# EAGLE design STM8L-FOX_80m_CNTL_V5_3 (EAGLE 7.7.0)
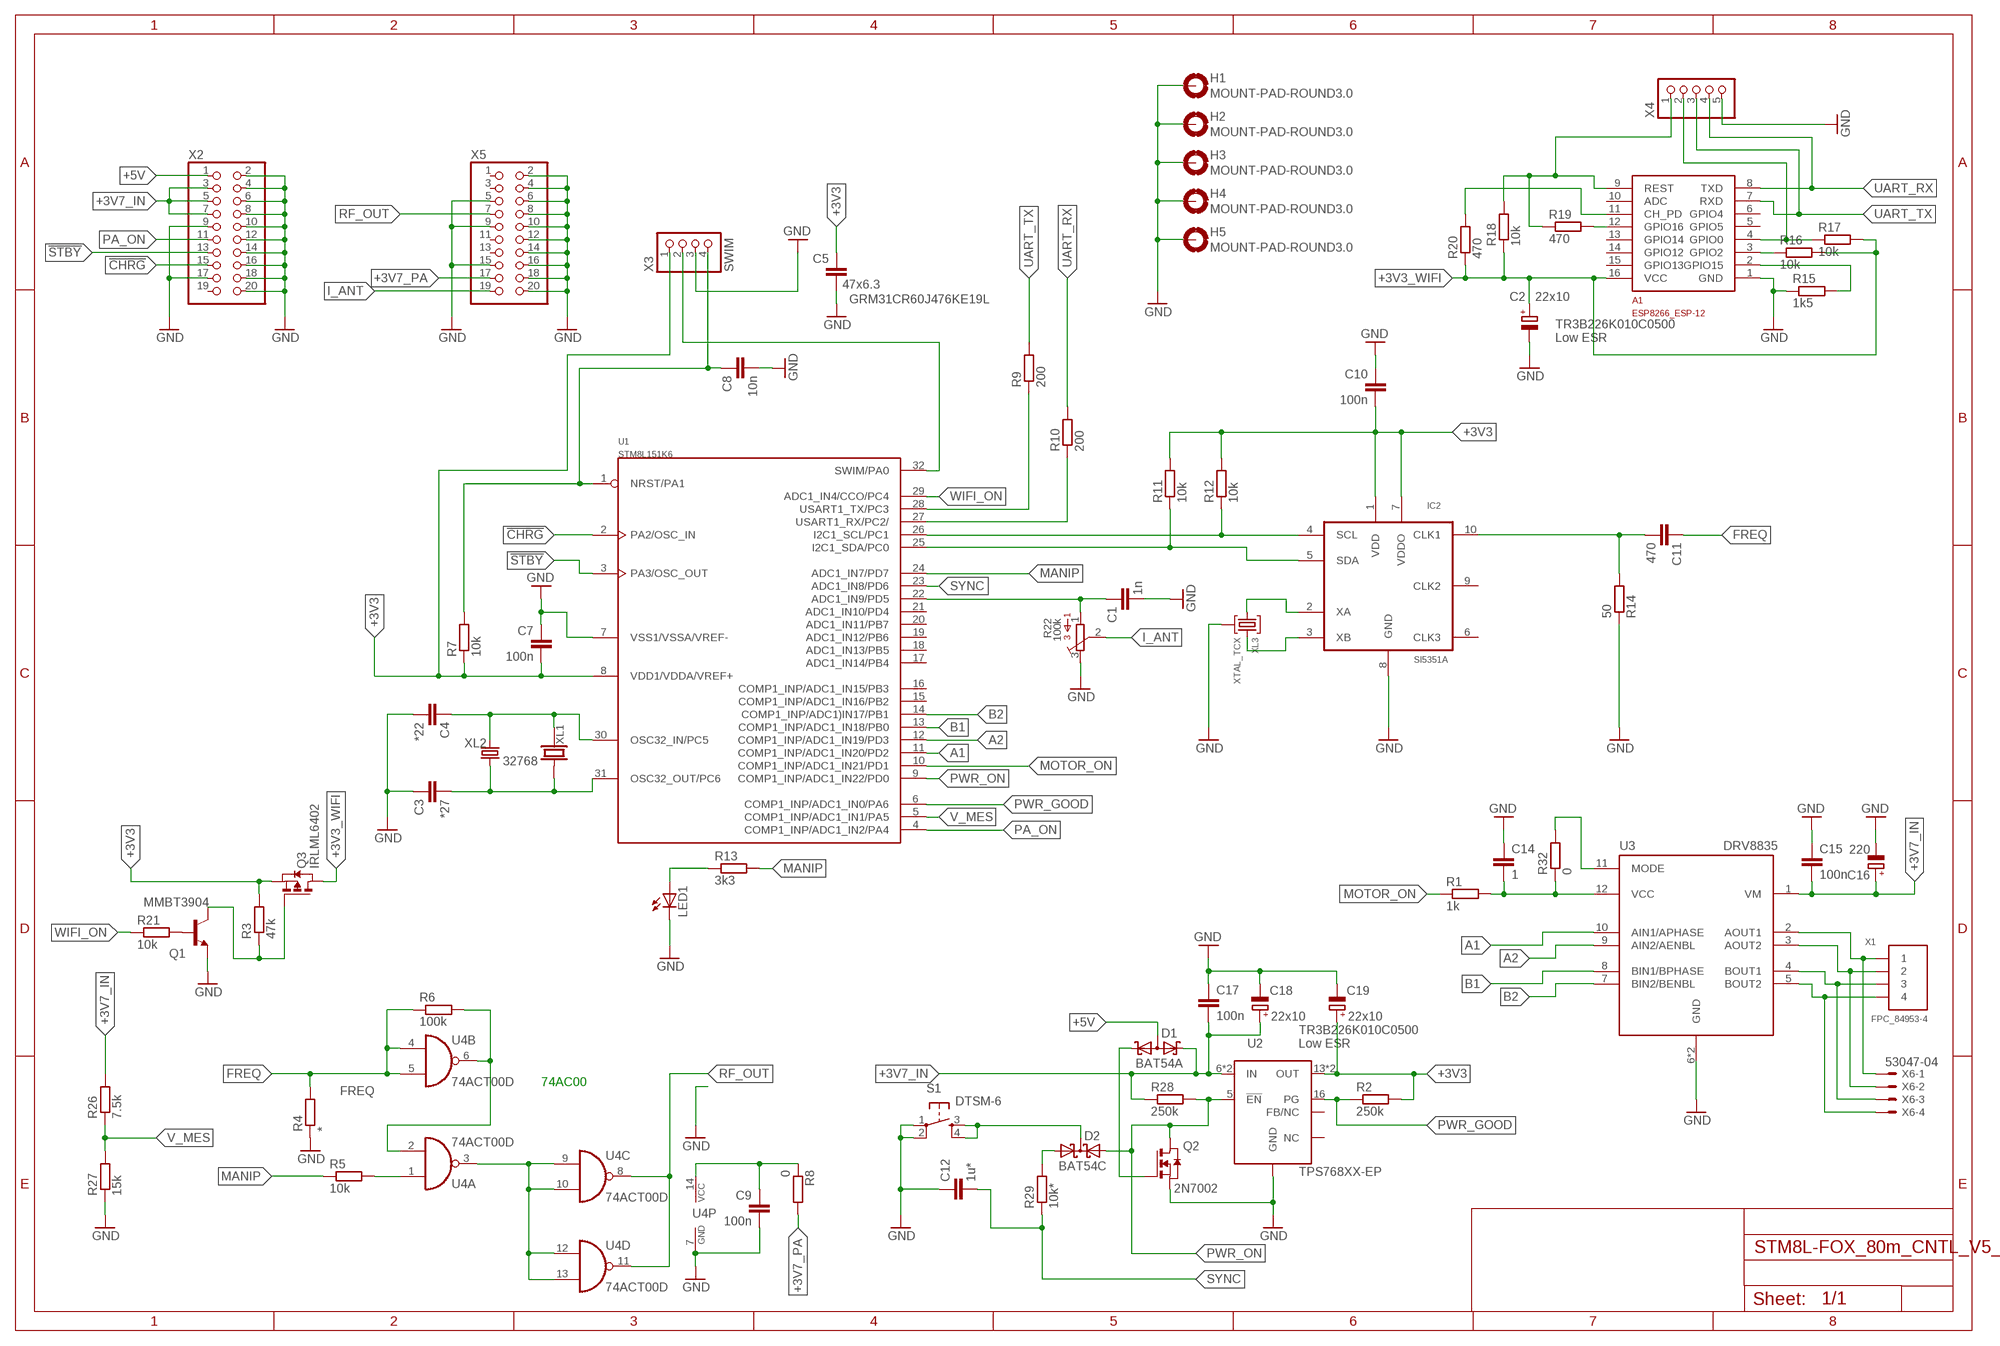
[diagram p0: schematic, sheet 1]

## Parts
A1  ESP8266_ESP-12  [ESP8266-ESP12]
C1  1n  C-EUC1206K  [C1206K]
C2  22x10  CPOL-EUB/3528-21W  [B/3528-21W]
C3  *27  C-EUC0805K  [C0805K]
C4  *22  C-EUC0805K  [C0805K]
C5  47x6.3  C-EUC1206K  [C1206K]
C7  100n  C-EUC1206K  [C1206K]
C8  10n  C-EUC0805K  [C0805K]
C9  100n  C-EUC1206K  [C1206K]
C10  100n  C-EUC1206K  [C1206K]
C11  470  C-EUC1206K  [C1206K]
C12  1u*  C-EUC1206K  [C1206K]
C14  1  C-EUC1206K  [C1206K]
C15  100n  C-EUC1206K  [C1206K]
C16  220  CPOL-EUC/6032-28R  [C/6032-28R]
C17  100n  C-EUC1206K  [C1206K]
C18  22x10  CPOL-EUB/3528-21W  [B/3528-21W]
C19  22x10  CPOL-EUB/3528-21W  [B/3528-21W]
D1  BAT54A  [SOT23]
D2  BAT54C  [SOT23]
H1  MOUNT-PAD-ROUND3.0  [3,0-PAD]
H2  MOUNT-PAD-ROUND3.0  [3,0-PAD]
H3  MOUNT-PAD-ROUND3.0  [3,0-PAD]
H4  MOUNT-PAD-ROUND3.0  [3,0-PAD]
H5  MOUNT-PAD-ROUND3.0  [3,0-PAD]
IC2  SI5351A  [MSOP10]
LED1  LED3MM  [LED3MM]
Q1  MMBT3904  MMBT3904LT1-NPN-SOT23-BEC  [SOT23-BEC]
Q2  2N7002  NMOSSOT23  [SOT-23]
Q3  IRLML6402  [SOT-23]
R1  1k  R-EU_R1206  [R1206]
R2  250k  R-EU_R1206  [R1206]
R3  47k  R-EU_R1206  [R1206]
R4  *  R-EU_R1206  [R1206]
R5  10k  R-EU_R1206  [R1206]
R6  100k  R-EU_R1206  [R1206]
R7  10k  R-EU_R1206  [R1206]
R8  0  R-EU_R1206  [R1206]
R9  200  R-EU_R1206  [R1206]
R10  200  R-EU_R1206  [R1206]
R11  10k  R-EU_R1206  [R1206]
R12  10k  R-EU_R1206  [R1206]
R13  3k3  R-EU_R1206  [R1206]
R14  50  R-EU_R1206  [R1206]
R15  1k5  R-EU_R1206  [R1206]
R16  10k  R-EU_R1206  [R1206]
R17  10k  R-EU_R1206  [R1206]
R18  10k  R-EU_R1206  [R1206]
R19  470  R-EU_R1206  [R1206]
R20  470  R-EU_R1206  [R1206]
R21  10k  R-EU_R1206  [R1206]
R22  100k  3362R  [3362R]
R26  7.5k  R-EU_R1206  [R1206]
R27  15k  R-EU_R1206  [R1206]
R28  250k  R-EU_R1206  [R1206]
R29  10k*  R-EU_R1206  [R1206]
R32  0  R-EU_R1206  [R1206]
S1  DTSM-6  [DTSM-6]
U1  STM8L151K6  [LQFP32-7X7]
U2  TPS768XX-EP  [TSSOP-20-PWP]
U3  DRV8835  [WSON_2X3]
U4  74ACT00D  [SO14]
X1  FPC_84953-4  [FPC_84953-4]
X2  PINHD-2X10  [2X10]
X3  SWIM  PINHD-1X4  [1X04]
X4  PINHD-1X5  [1X05]
X5  PINHD-2X10  [2X10]
X6  53047-04  [53047-04]
XL1  CRYSTALSMD  [EPSON-MC146]
XL2  32768  CRYSTALTC38H-PCB  [TC38H-PCB]
XL3  XTAL_TCX  [TXC]

## Nets
!CHRG!: U1.2(PA2/OSC_IN) X2.15
!STBY!: U1.3(PA3/OSC_OUT) X2.13
+3V3: C5.2 C7.1 C10.1 C19.+ IC2.1(VDD) IC2.7(VDDO) Q3.2(S) R2.2 R3.2 R7.1 R11.2 R12.2 U1.8(VDD1/VDDA/VREF+) U2.13(OUT) U2.14(OUT) X3.1
+3V3_WIFI: A1.16(VCC) C2.+ Q3.3(D) R16.2 R17.2 R18.1 R20.1
+3V7_IN: C15.2 C16.+ C17.2 C18.+ D1.2(K2) R26.2 R28.1 U2.6(IN) U2.7(IN) U3.1(VM) X2.3 X2.5 X2.7
+3V7_PA: R8.2 X5.17
+5V: D1.3(AA) X2.1
A1: U1.11(COMP1_INP/ADC1_IN20/PD2) U3.10(AIN1/APHASE)
A2: U1.12(COMP1_INP/ADC1_IN19/PD3) U3.9(AIN2/AENBL)
B1: U1.13(COMP1_INP/ADC1_IN18/PB0) U3.8(BIN1/BPHASE)
B2: U1.14(COMP1_INP/ADC1)IN17/PB1) U3.7(BIN2/BENBL)
FREQ: C11.1 R4.2 R6.1 U4.4(B:I0) U4.5(B:I1)
FRQ1: C11.2 IC2.10(CLK1) R14.2
GND: A1.1(GND) C1.1 C2.- C3.1 C4.2 C5.1 C7.2 C8.2 C9.2 C10.2 C12.1 C14.1 C15.1 C16.- C17.1 C18.- C19.- H1.B3,0(MOUNT) H2.B3,0(MOUNT) H3.B3,0(MOUNT) H4.B3,0(MOUNT) H5.B3,0(MOUNT) IC2.8(GND) LED1.K(C) Q1.E Q2.2(S) R4.1 R14.1 R15.1 R22.3 R27.1 S1.1 S1.2 U1.7(VSS1/VSSA/VREF-) U2.1(GND) U2.2(GND) U2.3(GND) U2.9(GND) U2.10(GND) U2.11(GND) U2.12(GND) U2.19(GND) U2.20(GND) U2.PAD(GND) U3.6(GND) U3.PAD(GND) U4.7(P:GND) X2.2 X2.4 X2.6 X2.8 X2.9 X2.10 X2.12 X2.14 X2.16 X2.17 X2.18 X2.20 X3.3 X4.5 X5.2 X5.4 X5.5 X5.6 X5.8 X5.9 X5.10 X5.12 X5.14 X5.15 X5.16 X5.18 X5.20 XL3.2 XL3.4
GP0: A1.4(GPIO0) R17.1 X4.2
I_ANT: R22.2 X5.19
MANIP: R5.1 R13.2 U1.24(ADC1_IN7/PD7)
MOTOR_ON: R1.1 U1.10(COMP1_INP/ADC1_IN21/PD1)
MOTR_ON: C14.2 R1.2 R32.1 U3.12(VCC)
N$1: D2.3(CC) S1.3 S1.4
N$2: C1.2 R22.1 U1.22(ADC1_IN9/PD5)
N$4: A1.2(GPIO15) R15.2
N$7: IC2.3(XB) XL3.3
N$9: U4.3(A:O) U4.9(C:I0) U4.10(C:I1) U4.12(D:I0) U4.13(D:I1)
N$10: IC2.2(XA) XL3.1
N$11: R6.2 U4.2(A:I1) U4.6(B:O)
N$12: D1.1(K1) Q2.3(G)
N$13: C4.1 U1.30(OSC32_IN/PC5) XL1.P$1 XL2.P$2
N$14: D2.1(A1) R29.2
N$15: A1.3(GPIO2) R16.1
N$18: A1.12(GPIO16) R19.2
N$19: Q1.B R21.2
N$20: A1.11(CH_PD) R20.2
N$21: LED1.A R13.1
N$23: R32.2 U3.11(MODE)
N$25: C3.2 U1.31(OSC32_OUT/PC6) XL1.P$2 XL2.P$1
N$34: R5.2 U4.1(A:I0)
N$35: U3.2(AOUT1) X1.1 X6.1
N$36: U3.3(AOUT2) X1.2 X6.2
N$37: U3.4(BOUT1) X1.3 X6.3
N$38: U3.5(BOUT2) X1.4 X6.4
N$666: C9.1 R8.1 U4.14(P:VCC)
N$667: Q1.C Q3.1(G) R3.1
NRST: C8.1 R7.2 U1.1(NRST/PA1) X3.4
PA_ON: U1.4(COMP1_INP/ADC1_IN2/PA4) X2.11
PWR_GOOD: R2.1 U1.6(COMP1_INP/ADC1_IN0/PA6) U2.16(PG)
PWR_ON: D2.2(A2) Q2.1(D) R28.2 U1.9(COMP1_INP/ADC1_IN22/PD0) U2.5(!EN!)
RESET: A1.9(REST) R18.2 R19.1 X4.1
RF_OUT: U4.8(C:O) U4.11(D:O) X5.7
SCL: IC2.4(SCL) R12.1 U1.26(I2C1_SCL/PC1)
SDA: IC2.5(SDA) R11.1 U1.25(I2C1_SDA/PC0)
SWIM: U1.32(SWIM/PA0) X3.2
SYNC: C12.2 R29.1 U1.23(ADC1_IN8/PD6)
UART_RX: A1.8(TXD) R10.2 X4.4
UART_TX: A1.7(RXD) R9.2 X4.3
USART1_RX: R10.1 U1.27(USART1_RX/PC2/)
USART1_TX: R9.1 U1.28(USART1_TX/PC3)
V_MES: R26.1 R27.2 U1.5(COMP1_INP/ADC1_IN1/PA5)
WIFI_ON: R21.1 U1.29(ADC1_IN4/CCO/PC4)
Unconnected: A1.5(GPIO5) A1.6(GPIO4) A1.10(ADC) A1.13(GPIO14) A1.14(GPIO12) A1.15(GPIO13) IC2.6(CLK3) IC2.9(CLK2) U1.15(COMP1_INP/ADC1_IN16/PB2) U1.16(COMP1_INP/ADC1_IN15/PB3) U1.17(ADC1_IN14/PB4) U1.18(ADC1_IN13/PB5) U1.19(ADC1_IN12/PB6) U1.20(ADC1_IN11/PB7) U1.21(ADC1_IN10/PD4) U2.4(NC) U2.8(NC) U2.15(FB/NC) U2.17(NC) U2.18(NC) X2.19 X5.1 X5.3 X5.11 X5.13

## Notes on the sheet
- GRM31CR60J476KE19L
- TR3B226K010C0500
  Low ESR
- TR3B226K010C0500
  Low ESR
- 74AC00

## Library data of the parts
A1 = esp-12:ESP8266_ESP-12
C1 C3-C5 C7-C12 C14 C15 C17 = rcl:C-EU: CAPACITOR, European symbol
C2 C16 C18 C19 = rcl:CPOL-EU: POLARIZED CAPACITOR, European symbol
D1 = diode:BAT54A: Schottky Diodes Source: Fairchild .. BAT54.pdf
D2 = diode:BAT54C: Schottky Diodes Source: Fairchild .. BAT54.pdf
H1-H5 = holes:MOUNT-PAD-ROUND: MOUNTING PAD, round
IC2 = zelazko:SI5351
LED1 = led:LED: LED OSRAM: - CHIPLED LG R971, LG N971, LY N971, LG Q971, LY Q971, LO R971, LY R971 LH N974, LH R974 LS Q976, LO Q976, LY Q976 LO Q996 - Hyper CHIPLED LW Q18S LB Q993, LB Q99A, LB R99A - SideLED LS A670, LO A670, LY A670, LG A670, LP A670 LB A673, LV A673, LT A673, LW A673 LH A674 LY A675 LS A676, LA A676, LO A676, LY A676, LW A676 LS A679, LY A679, LG A679 - Hyper Micro SIDELED® LS Y876, LA Y876, LO Y876, LY Y876 LT Y87S - SmartLED LW L88C, LW L88S LB L89C, LB L89S, LG L890 LS L89K, LO L89K, LY L89K LS L896, LA L896, LO L896, LY L896 - TOPLED LS T670, LO T670, LY T670, LG T670, LP T670 LSG T670, LSP T670, LSY T670, LOP T670, LYG T670 LG T671, LOG T671, LSG T671 LB T673, LV T673, LT T673, LW T673 LH T674 LS T676, LA T676, LO T676, LY T676, LB T676, LH T676, LSB T676, LW T676 LB T67C, LV T67C, LT T67C, LS T67K, LO T67K, LY T67K, LW E67C LS E67B, LA E67B, LO E67B, LY E67B, LB E67C, LV E67C, LT E67C LW T67C LS T679, LY T679, LG T679 LS T770, LO T770, LY T770, LG T770, LP T770 LB T773, LV T773, LT T773, LW T773 LH T774 LS E675, LA E675, LY E675, LS T675 LS T776, LA T776, LO T776, LY T776, LB T776 LHGB T686 LT T68C, LB T68C - Hyper Mini TOPLED® LB M676 - Mini TOPLED Santana® LG M470 LS M47K, LO M47K, LY M47K Source: http://www.osram.convergy.de LUXEON: - LUMILED® LXK2-PW12-R00, LXK2-PW12-S00, LXK2-PW14-U00, LXK2-PW14-V00 LXK2-PM12-R00, LXK2-PM12-S00, LXK2-PM14-U00 LXK2-PE12-Q00, LXK2-PE12-R00, LXK2-PE12-S00, LXK2-PE14-T00, LXK2-PE14-U00 LXK2-PB12-K00, LXK2-PB12-L00, LXK2-PB12-M00, LXK2-PB14-N00, LXK2-PB14-P00, LXK2-PB14-Q00 LXK2-PR12-L00, LXK2-PR12-M00, LXK2-PR14-Q00, LXK2-PR14-R00 LXK2-PD12-Q00, LXK2-PD12-R00, LXK2-PD12-S00 LXK2-PH12-R00, LXK2-PH12-S00 LXK2-PL12-P00, LXK2-PL12-Q00, LXK2-PL12-R00 Source: www.luxeon.com KINGBRIGHT: KA-3528ASYC Source: www.kingbright.com
Q1 = transistor:*-NPN-: NPN Transistror BF959 corrected 2008.03.06
Q2 = zetex:NMOSSOT23: MOS FET; OC_FARNELL: unknown; OC_NEWARK: unknown
Q3 = IRLML6402:IRLML6402
R1-R21 R26-R29 R32 = rcl:R-EU_: RESISTOR, European symbol
R22 = bourns-pot:3362: 3362 Series 1/4" Square Trimmer
S1 = switch-tact:DTSM-6
U1 = stm8l15x:STM8L151K6
U2 = TPS768xx-EP:TPS768XX-EP: TPS768xx-EP 1 Ampere low-dropout voltage regulator
U3 = bt_motordriver:DRV8835: DRV8835 DUAL LOW VOLTAGE H-BRIDGE IC The DRV8835 provides an integrated motor driver solution for cameras, consumer products, toys, and other low voltage or battery-powered motion control applications. The device has two H-bridge drivers, and can drive two DC motors or one stepper motor, as well as other devices like solenoids. The device has two H-bridge drivers, and drives two DC motors or one stepper motor, as well as other devices like solenoids. The output driver block for each consists of N-channel power MOSFETs configured as an H-bridge to drive the motor winding. An internal charge pump generates gate drive voltages. 1.5-A Maximum Drive Current Per H-Bridge Configure Bridges Parallel for 3-A Drive Curren 0-V to 11-V Motor-Operating Supply-Voltage 2-V to 7-V Logic Supply-Voltage Flexible PWM or PHASE/ENABLE Interface Low-Power Sleep Mode With 95-nA Maximum Supply Current Tiny 2.00-mm × 3.00-mm WSON Package Reference: http://www.ti.com/lit/ds/symlink/drv8835.pdf
U4 = 74xx-eu:74*00: Quad 2-input NAND gate
X1 = amp-fpc:FPC_84953-4
X2 X5 = pinhead:PINHD-2X10: PIN HEADER
X3 = pinhead:PINHD-1X4: PIN HEADER
X4 = pinhead:PINHD-1X5: PIN HEADER
X6 = con-molex:53?-04: CONNECTOR wire to board 1.25 mm (.049 inch) pitch header; MF: WALDOM/MOLEX; MPN: 53047-0410; OC_FARNELL: 9733060; OC_NEWARK: 38C9900
XL1 = Ai_FrequencyControl:CRYSTAL: Cylinder: CMR200T-32.768KDZBT
XL2 = crystal:CRYSTAL: CRYSTAL
XL3 = zelazko:XTAL_TCX

## Board
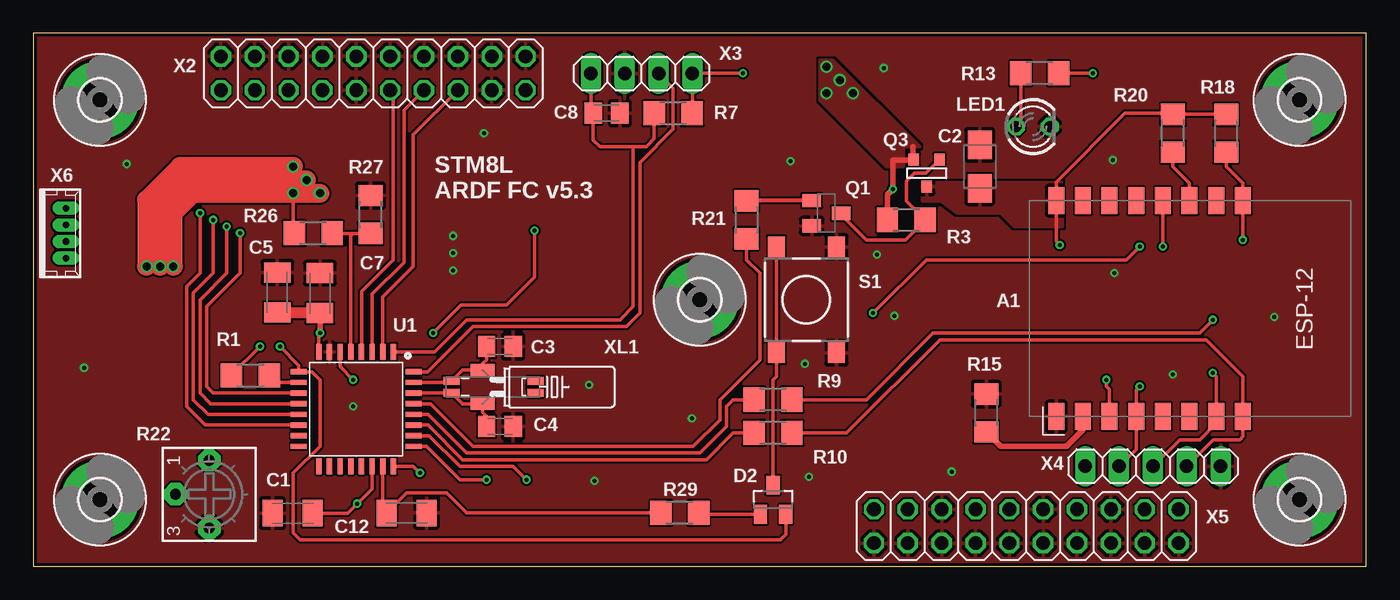
[diagram p1: board, top side]
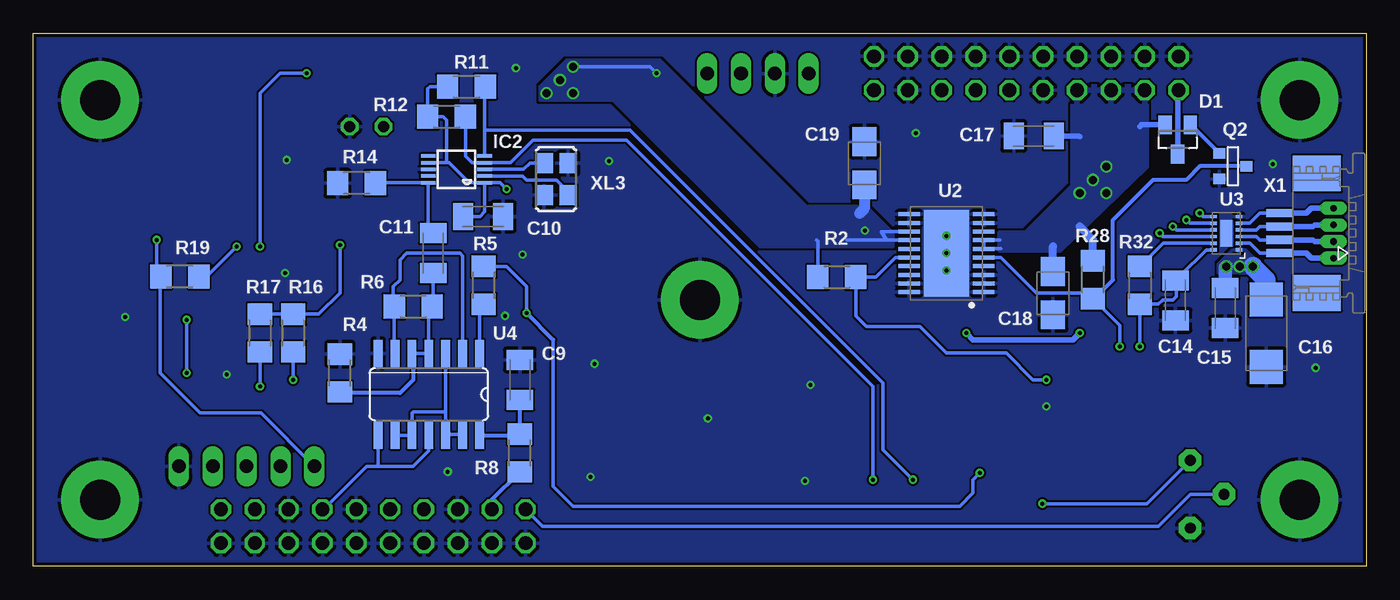
[diagram p2: board, bottom side, seen from below]

Size 100 x 40 mm. Coordinates in mm from the lower left corner, seen from the top.
Outline: 0,0 100,0 100,40 0,40 0,0
Copper layers (1*16): Top 0.035mm / dielectric 1.5mm / Bottom 0.035mm
Design rules "SeeedStudio_2layer_DRU_no_angle_20140221 *": minimum track width 6mil, minimum drill 0.3mm, track to track 6mil, track to pad 6mil, pad to pad 6mil, via to via 6mil, smd to smd 0mil, copper to edge 10mil, drill to drill 10mil, minimum pad ring 10mil, minimum via ring 6mil, stop-mask expansion 2mil, vias tented up to drill 100mil, thermal gap 10mil

### Footprints (pad centres in the part's own frame; a part is rotated, then mirrored left to right if it is on the bottom)
ESP8266-ESP12 = smd 2 x 1.2: 1 16.2,2; 2 16.2,4; 3 16.2,6; 4 16.2,8; 5 16.2,10; 6 16.2,12; 7 16.2,14; 8 16.2,16; 9 0,16; 10 0,14; 11 0,12; 12 0,10; 13 0,8; 14 0,6; 15 0,4; 16 0,2
C1206K = smd 1.5 x 2: 1 -1.5,0; 2 1.5,0
B/3528-21W = smd 2.15 x 1.8: + 1.625,0; - -1.625,0
C0805K = smd 1.3 x 1.6: 1 -1,0; 2 1,0
C/6032-28R = smd 2.55 x 2.5: + 2.525,0; - -2.525,0
SOT23 = smd 1 x 1.4: 1 -0.95,-1.1; 2 0.95,-1.1; 3 0,1.1
3,0-PAD = drill 3 pad 5.842: B3,0 0,0
MSOP10 = smd 0.27 x 1.1: 1 -1,-2.113; 2 -0.5,-2.113; 3 0,-2.113; 4 0.5,-2.113; 5 1,-2.113; 6 1,2.113; 7 0.5,2.113; 8 0,2.113; 9 -0.5,2.113; 10 -1,2.113
LED3MM = drill 0.813 octagon: A -1.27,0; K 1.27,0
SOT23-BEC = smd 1 x 1.4: B -0.95,-1.1; C 0,1.1; E 0.95,-1.1
SOT-23 = smd 0.787 x 0.889: 1 0.025,-1.016; 2 -0.94,1.016; 3 0.991,1.016
SOT-23' = smd 0.787 x 0.889: 1 0.991,1.016; 2 -0.94,1.016; 3 0.025,-1.016
R1206 = smd 1.6 x 1.803: 1 -1.422,0; 2 1.422,0
3362R = drill 0.813 pad 1.676 octagon: 1 -2.54,0; 2 0,-2.54; 3 2.54,0
DTSM-6 = smd 1.55 x 1.3: 1 -3.975,2.25; 2 3.975,2.25; 3 -3.975,-2.25; 4 3.975,-2.25
LQFP32-7X7 = smd 1.2 x 0.4: 1 -4.3,2.8; 2 -4.3,2; 3 -4.3,1.2; 4 -4.3,0.4; 5 -4.3,-0.4; 6 -4.3,-1.2; 7 -4.3,-2; 8 -4.3,-2.8; 17 4.3,-2.8; 18 4.3,-2; 19 4.3,-1.2; 20 4.3,-0.4; 21 4.3,0.4; 22 4.3,1.2; 23 4.3,2; 24 4.3,2.8 | smd 0.4 x 1.2: 9 -2.8,-4.3; 10 -2,-4.3; 11 -1.2,-4.3; 12 -0.4,-4.3; 13 0.4,-4.3; 14 1.2,-4.3; 15 2,-4.3; 16 2.8,-4.3; 25 2.8,4.3; 26 2,4.3; 27 1.2,4.3; 28 0.4,4.3; 29 -0.4,4.3; 30 -1.2,4.3; 31 -2,4.3; 32 -2.8,4.3
TSSOP-20-PWP = smd 0.3 x 1.6: 1 -2.925,-2.8; 2 -2.275,-2.8; 3 -1.625,-2.8; 4 -0.975,-2.8; 5 -0.325,-2.8; 6 0.325,-2.8; 7 0.975,-2.8; 8 1.625,-2.8; 9 2.275,-2.8; 10 2.925,-2.8; 11 2.925,2.8; 12 2.275,2.8; 13 1.625,2.8; 14 0.975,2.8; 15 0.325,2.8; 16 -0.325,2.8; 17 -0.975,2.8; 18 -1.625,2.8; 19 -2.275,2.8; 20 -2.925,2.8 | smd 6.5 x 3.4: PAD 0,0
WSON_2X3 = smd 0.25 x 0.5: 1 -1.25,-0.95; 2 -0.75,-0.95; 3 -0.25,-0.95; 4 0.25,-0.95; 5 0.75,-0.95; 6 1.25,-0.95; 7 1.25,0.95; 8 0.75,0.95; 9 0.25,0.95; 10 -0.25,0.95; 11 -0.75,0.95; 12 -1.25,0.95 | smd 2 x 0.9: PAD 0,0
SO14 = smd 0.66 x 2.032: 1 -3.81,-3.073; 2 -2.54,-3.073; 3 -1.27,-3.073; 4 0,-3.073; 5 1.27,-3.073; 6 2.54,-3.073; 7 3.81,-3.073; 8 3.81,3.073; 9 2.54,3.073; 10 1.27,3.073; 11 0,3.073; 12 -1.27,3.073; 13 -2.54,3.073; 14 -3.81,3.073
FPC_84953-4 = smd 0.61 x 2: 1 -1.5,1; 2 -0.5,1; 3 0.5,1; 4 1.5,1 | smd 2.68 x 3.6: PAD1 -4.49,-1.8; PAD2 4.49,-1.8
2X10 = drill 1.016 octagon: 1 -11.43,-1.27; 2 -11.43,1.27; 3 -8.89,-1.27; 4 -8.89,1.27; 5 -6.35,-1.27; 6 -6.35,1.27; 7 -3.81,-1.27; 8 -3.81,1.27; 9 -1.27,-1.27; 10 -1.27,1.27; 11 1.27,-1.27; 12 1.27,1.27; 13 3.81,-1.27; 14 3.81,1.27; 15 6.35,-1.27; 16 6.35,1.27; 17 8.89,-1.27; 18 8.89,1.27; 19 11.43,-1.27; 20 11.43,1.27
1X04 = drill 1.016 long: 1 -3.81,0; 2 -1.27,0; 3 1.27,0; 4 3.81,0
1X05 = drill 1.016 long: 1 -5.08,0; 2 -2.54,0; 3 0,0; 4 2.54,0; 5 5.08,0
53047-04 = drill 0.5 pad 0.698 long: 1 1.875,0.45; 2 0.625,0.45; 3 -0.625,0.45; 4 -1.875,0.45
EPSON-MC146 = smd 1.2 x 0.6: NC1 3.2,0.45; NC2 3.2,-0.45; P$1 -3.1,-0.45; P$2 -3.1,0.45
TC38H-PCB = smd 0.914 x 1.778: P$1 -1.27,0; P$2 1.27,0
TXC = smd 1.5 x 1.3: 1 -1.2,-0.9; 2 1.2,-0.9; 3 1.2,0.9; 4 -1.2,0.9

### Placement (x,y rotation side)
A1  74.75,27.44 270 top
C1  19.45,3.99 0 top
C2  71,30 270 top
C3  35,16.5 180 top
C4  35,10.5 0 top
C5  18.31,20.56 270 top
C7  21.5,20.5 90 top
C8  43,34 0 top
C9  63.5,14 90 bottom
C10  66.25,26.25 0 bottom
C11  70,23.5 90 bottom
C12  28,4 180 top
C14  14.31,19.95 90 bottom
C15  10.58,19.37 90 bottom
C16  7.5,17.5 90 bottom
C17  24.94,32.3 0 bottom
C18  23.5,20.5 90 bottom
C19  37.65,30.24 270 bottom
D1  14.15,32.03 180 bottom
D2  55.5,5 0 top
H1  5,35 0 top
H2  5,5 0 top
H3  50,20 0 top
H4  95,35 0 top
H5  95,5 0 top
IC2  68.26,29.79 90 bottom
LED1  75,33 0 top
Q1  59.5,26.5 270 top
Q2  10,30 90 bottom
Q3  IRLML6402  [SOT-23']  67,29.5 0 top
R1  16.28,14.31 180 top
R2  39.72,21.71 180 bottom
R3  65.5,26 180 top
R4  77,14.5 270 bottom
R5  66.2,21.08 270 bottom
R6  71.5,19.5 180 bottom
R7  48,34 180 top
R8  63.5,8.5 270 bottom
R9  55.5,12.5 0 top
R10  55.5,10 0 top
R11  67.5,36 180 bottom
R12  69,33.75 180 bottom
R13  75.5,37 0 top
R14  75.75,28.75 0 bottom
R15  71.5,11.5 270 top
R16  80.5,17.5 90 bottom
R17  83,17.5 90 bottom
R18  89.5,32.5 270 top
R19  89,21.75 0 bottom
R20  85.5,32.5 270 top
R21  53.5,26 90 top
R22  13.2,5.4 270 top
R26  21,25 180 top
R27  25.3,26.4 270 top
R28  20.5,21.5 270 bottom
R29  48.5,4 0 top
R32  16.98,21.09 90 bottom
S1  58,20 270 top
U1  24.22,11.8 270 top
U2  31.5,23.5 90 bottom
U3  10.5,25 90 bottom
U4  70.33,12.9 180 bottom
X1  5.5,25 90 bottom
X2  25.5,37 0 top
X3  45.64,36.98 180 top
X4  84,7.5 0 top
X5  74.5,3 180 top
X6  2,25 270 top
XL1  34.48,13.46 0 top
XL2  33.7,13.46 270 top
XL3  60.77,29.04 90 bottom

### Tracks (layer width: path | path; a pad name or v marks a point on that pad's centre or on a via)
!CHRG!
  Top 0.254: 32,35.58 X2.15 28.5,32.38 28.5,22.5 26.22,20.22 U1.2
!STBY!
  Top 0.254: U1.3 25.42,20.42 27.8,22.8 27.8,34.22 X2.13
+3V3  (via drill 0.3, 0.6)
  Top 0.254: 49.45,34.03 X3.1 49.47,37 v53.25,37 | 21.4,16.12 U1.8 21.42,17.42 v21.5,17.5 | v30,17.5 32.1,19.6 35.5,19.6 37.6,21.7 v37.6,25.2 | Q3.2 65.52,30.52 65.5,30.5
  Top 0.406: C7.1 v21.5,17.5 | 66,31.5 66,30.5 65.5,30.5 64.5,30.5 v64.5,28.3 64.08,27.88 R3.2
  Top 0.813: C7.1 18.37,19 C5.2
  Top 1.016: R7.1 49.45,34.03
  Bottom 0.25: U2.14 34.33,24.5 | U2.13 34.33,25.1
  Bottom 0.254: IC2.1 67.29,28.79 68.79,30.29 69,30.29 | IC2.7 69,30.29 | 36,24.5 36.38,25.12 U2.13 | 38,24.5 38.98,24.48 U2.14 | R2.2 41.14,24.39 41.25,24.5 | R11.2 70.25,36 70.42,35.83 R12.2 69.25,33.75 69,33.5 69,30.29 | C10.1 66.5,26.25 66.14,26.61 IC2.1 | v53.25,37 53.75,37.5 v59.5,37.5 | IC2.1 64.99,28.79 v64.5,28.3
  Bottom 0.305: U2.14
  Bottom 0.406: v21.5,17.5 22,17 29.5,17 v30,17.5
  Bottom 0.813: C19.+ 37.65,26.85 38,26.5
  other vias: 61.5,35.5 60.5,36.5 59.5,35.5
  pour Bottom: 35.5,24 45.5,24 56.5,35 62,35 62,36 60,38 53,38 42,27 37.5,27 35.5,25
  pour Top: 59,38 59,35 64,30 65.28,30 65.28,31.5 66.5,31.5 60,38
+3V3_WIFI  (via drill 0.3)
  Top 0.254: R18.1 R20.1 85.42,34 81.9,34 76.75,28.85 A1.16 76.75,24.35 v77,24.1
  Bottom 0.254: v77,24.1 77,20.5 78.58,18.92 R16.2 R17.2
  pour Top (isolate 0.254): 66.7,28.8 77.2,28.8 77.2,25.5 73.6,25.5 72.6,26.5 69.3,26.5 68.1,27.4 66.7,27.4
+3V7_IN  (via drill 0.6)
  Top 0.254: R26.2 19.5,25.08 v19.5,28
  Top 1.422: v10.5,22.5 10.5,26.5 12,28 v19.5,28 v21.5,28 | v20.5,29 11.5,29 9.5,27 v9.5,22.5 | v19.5,30 11,30 8.5,27.5 v8.5,22.5
  Bottom 0.25: 10.5,22.8 v10.5,22.5 | 8.5,22.7 v8.5,22.5
  Bottom 0.254: 27.5,24.48 U2.7 U2.6 27.42,23.83
  Bottom 0.305: R28.1 20.5,23
  Bottom 0.406: C17.2 21.55,32.3 21.5,32.25 | D1.2 16.87,33.13 17,33
  Bottom 0.61: C18.+ 23.5,24 | 20.5,23 20.5,24.5 21.5,25.5
  Bottom 1.016: v10.5,22.5 10.58,22.42 C15.2
  Bottom 1.422: C16.+ 7.5,21.5 v8.5,22.5
  pour Bottom: 27.5,23.75 27.5,25 25.5,25 22,28.5 22,36 16.5,36 16.5,30 23,23.75
  pour Bottom: 9.2,23.9 9.9,23.9 11.1,22.7 11.1,22 7.9,22 7.9,22.6
+3V7_PA
  Bottom 0.305: X5.17 65.61,4.97 R8.2
+5V
  Bottom 0.406: D1.3 14.15,35.65 X2.1
A1  (via drill 0.3)
  Top 0.254: U1.11 13.5,13 13,13.5 13,19.5 15.5,22 v15.5,25
  Bottom 0.25: U3.10 15.25,24.75 v15.5,25
A2  (via drill 0.3)
  Top 0.254: U1.12 13.3,12.2 12.5,13 12.5,20 14.5,22 v14.5,25.5
  Bottom 0.25: U3.9 14.25,25.25 v14.5,25.5
B1  (via drill 0.3)
  Top 0.254: U1.13 13.1,11.4 12,12.5 12,20.5 13.5,22 v13.5,26
  Bottom 0.25: U3.8 13.25,25.75 v13.5,26
B2  (via drill 0.3)
  Top 0.254: U1.14 12.9,10.6 11.5,12 11.5,21 12.5,22 v12.5,26.5
  Bottom 0.25: U3.7 12.25,26.25 v12.5,26.5
FREQ
  Bottom 0.254: C11.1 70,19.58 R6.1 70.33,19.25 U4.4 U4.5 71.5,15.87
  Bottom 0.305: 71.5,15.87 71.5,14 72.5,13 76.92,13 R4.2
FRQ1
  Bottom 0.254: C11.2 70.37,25.37 IC2.10 74.29,28.79 R14.2
GND  (via drill 0.3)
  other vias: 24,12 31.5,23.5 31.5,24.8 31.5,22.2 41.7,13.6 33.8,32.5 42.1,6.4 57.9,15.2 58.2,6.7 68.9,7.1 93.1,18.7 64.6,18.8 63.3,23.4 56.8,30.4 63.8,37.4 81,30.5 81.1,22 85.5,14.4 7,30.2 3.8,14.9 49.4,11.1
  pour Top (rank 2): -1.9,42.9 102.5,42.9 102.5,-2.2 -4.7,-2.2 -4.7,0.3
  pour Bottom (rank 2): -4.3,44.5 105,44.5 105,-3.6 -7.6,-3.6 -7.6,-0.5
GP0  (via drill 0.3)
  Top 0.254: X4.2 82.75,8.79 A1.4 82.75,13.25 v83,13.5
  Bottom 0.254: R17.1 v83,13.5
I_ANT
  Bottom 0.254: R22.2 13.2,5.4 15.6,3 61.8,3 X5.19
MANIP  (via drill 0.3)
  Top 0.254: U1.24 28.5,7.5 v29,7 | v63,19 67,23 82,23 v83,24 | R13.2 v79.5,37
  Bottom 0.254: v29,7 29.5,6.5 29.5,5.5 30.5,4.5 59.5,4.5 61,6 61,17 | v83,24 83,35.5 81.5,37 v79.5,37 | 66.2,22.2 R5.1 64.5,22.5 63,21 v63,19
  Bottom 0.305: 61,17 v63,19
MOTOR_ON
  Top 0.254: U1.10 18.22,13.8 R1.1
MOTR_ON  (via drill 0.3)
  Top 0.254: R1.2 14.86,14.36 v17,16.5
  Bottom 0.25: U3.12 12.01,23.75 13.95,21.81
  Bottom 0.254: 13.95,21.81 C14.2 14.25,21.39 14.25,20.25 14.5,20 15.25,20 15.59,19.66 R32.1 17,19.64 v17,16.5
N$1
  Top 0.254: S1.3 S1.4 55.75,14.25 55.5,14 D2.3
N$2  (via drill 0.3)
  Top 0.254: 25.4,7.48 U1.22 25.42,5.82 v24.3,4.7 23.59,3.99 C1.2
  Bottom 0.254: R22.1 16.44,4.7 v24.3,4.7
N$4
  Top 0.406: R15.2 72.58,9 77.5,9 78.75,10.25 A1.2
N$7
  Bottom 0.254: IC2.3 63.21,29.79 62.75,30.25 61.68,30.25 XL3.3
N$9
  Bottom 0.254: U4.9 U4.10 71.6,11.5 71.5,11.6 69.06,11.6 | U4.13 67.84,9.88 69,9.88 U4.12 69.06,11.6 | 69,15.91 U4.3 69.06,11.76 69.06,11.6
N$10
  Bottom 0.254: XL3.1 59.88,28.12 60.75,29 63,29 63.29,29.29 IC2.2
N$11
  Bottom 0.254: U4.6 72.92,16.03 R6.2 73,19.58 73,21 72.5,21.5 72.5,23 72,23.5 68,23.5 67.79,23.29 U4.2
N$12
  Bottom 0.305: D1.1 13.15,33.13 Q2.3
N$13
  Top 0.254: U1.30 XL1.P$1 32.2,12.19 XL2.P$2 33.7,11.55 34,11.25 C4.1
N$14
  Top 0.254: R29.2 50.02,3.9 D2.1
N$15  (via drill 0.3)
  Top 0.254: A1.3 80.75,13.25 80.5,13.5 v80.5,14
  Bottom 0.254: R16.1 v80.5,14
N$18  (via drill 0.3)
  Top 0.254: v84.75,24 A1.12
  Bottom 0.254: R19.2 87,21.75 v84.75,24
N$19
  Top 0.305: Q1.B 53.53,27.45 R21.2
N$20
  Top 0.254: R20.2 85.5,30 86.75,28.75 A1.11
N$21
  Top 0.254: LED1.A 74.08,33.35 R13.1
N$23
  Bottom 0.25: U3.11 15.24,24.25 R32.2
  Bottom 0.254: R32.2
N$25
  Top 0.254: U1.31 31.27,13.8 XL1.P$2 32.2,14.73 XL2.P$1 33.7,15.2 34,15.5 C3.2
N$34
  Bottom 0.254: U4.1 66.52,19.35 R5.2
N$35
  Bottom 0.25: U3.2 8.75,24.25 8,23.5 X1.1
  Bottom 0.406: X1.1 4.5,23.5 4.12,23.12 X6.1
N$36
  Bottom 0.25: U3.3 8.25,24.75 8,24.5 X1.2
  Bottom 0.406: X1.2 4,24.5 3.88,24.38 X6.2
N$37
  Bottom 0.25: U3.4 8.25,25.25 8,25.5 X1.3
  Bottom 0.406: X1.3 4,25.5 3.88,25.62 X6.3
N$38
  Bottom 0.25: U3.5 8.75,25.75 8,26.5 X1.4
  Bottom 0.406: X1.4 4.5,26.5 4.12,26.88 X6.4
N$666
  Bottom 0.305: U4.14 63.6,9.82 R8.1 C9.1
N$667
  Top 0.254: Q3.1 66.97,29.5 66.1,29.5 65.5,28.9 65.5,27.42 R3.1 65.42,24.5 62.5,24.5 60.6,26.4 Q1.C
NRST
  Top 0.254: U1.1 30.1,16.1 32.5,18.5 44,18.5 45,19.5 45,31.5 | 45,31.5 42.5,31.5 42,32 C8.1 41.83,34.17 X3.4 | 45,31.5 46,31.5 46.58,32.08 R7.2
PA_ON
  Top 0.254: U1.4 24.62,20.62 27,23 27,35.5 X2.11
PWR_GOOD  (via drill 0.3)
  Top 0.254: U1.6 23.02,14.98 v24,14
  Bottom 0.254: U2.16 35.33,23.18 36.79,21.71 R2.1 38.3,18.8 37.5,18 33.5,18 31.5,16 27,16 25,14 v24,14
PWR_ON  (via drill 0.3)
  Top 0.254: v18.5,16.5 19.92,15.08 U1.9 20.9,14.6 21.5,14 21.5,9 19.5,7 19.5,2.5 20,2 56.05,2 56.45,2.4 D2.2
  Bottom 0.254: v18.5,16.5 18.5,18.08 R28.2 | 20.92,20.5 24.75,20.5 27.43,23.18 U2.5
  Bottom 0.305: R28.2 20.92,20.5 20,20.5 19,21.5 19,26 16,29 13.5,29 12.47,30.02 Q2.1
RESET  (via drill 0.3)
  Top 0.254: R18.2 89.5,30 90.75,28.75 A1.9 v90.75,24.5
  Bottom 0.254: X4.1 82.92,11.5 87.5,11.5 90.5,14.5 90.5,21.67 R19.1 90.75,22.08 v90.75,24.5
RF_OUT
  Bottom 0.254: X5.7 78.23,4.27 75,7.5 74.2,7.5 | 74.2,7.5 71.5,7.5 70.33,8.67 U4.11 | U4.8 74.14,7.56 74.2,7.5
SCL  (via drill 0.3)
  Top 0.254: U1.26 29.7,9.8 32,7.5 36,7.5 v37,6.5
  Bottom 0.254: v37,6.5 37,13.5 55.5,32 62.5,32 64.21,30.29 IC2.4 67.09,30.29 67.58,30.78 R12.1
SDA  (via drill 0.3)
  Top 0.254: U1.25 29.5,9 32,6.5 v34,6.5
  Bottom 0.254: 66.14,32.75 55.25,32.75 36.25,13.75 36.25,8.75 v34,6.5 | R11.1 66.14,35.94 66.14,32.75 | 66.14,32.75 IC2.5
SWIM
  Top 0.254: X3.2 48,35.88 48,32.8 45.5,30.3 45.5,19 44.5,18 33,18 29.6,14.6 U1.32
SYNC
  Top 0.254: U1.23 26.22,4.28 C12.2 28,5.5 31,5.5 32.5,4 R29.1
UART_RX
  Top 0.254: X4.4 88.54,9.5 90.5,9.5 90.75,9.75 A1.8 90.75,14.25 88,17 68,17 61,10 R10.2
UART_TX  (via drill 0.3)
  Top 0.254: X4.3 86,9.5 87.5,9.5 88.75,10.75 A1.7 88.75,14.25 v88.5,14.5 | R9.2 62.5,12.5 67.5,17.5 87.5,17.5 v88.5,18.5
  Bottom 0.254: v88.5,18.5 v88.5,14.5
USART1_RX
  Top 0.254: U1.27 29.6,10.6 32.2,8 50.5,8 52.5,10 R10.1
USART1_TX
  Top 0.254: U1.28 29.6,11.4 32.5,8.5 50,8.5 52,10.5 52,12 52.5,12.5 R9.1
V_MES
  Top 0.254: U1.5 23.82,24.8 24,24.98 | R27.2 24,24.98 | 24,24.98 22.44,24.98 R26.1
WIFI_ON
  Top 0.254: U1.29 29.8,12.2 33,9 49.5,9 51.5,11 51.5,12.5 54.5,15.5 54.5,22 53.5,23 R21.1

### Text on the board
tNames: STM8L / ARDF FC v5.3